# EAGLE design headphone (EAGLE 6.4)
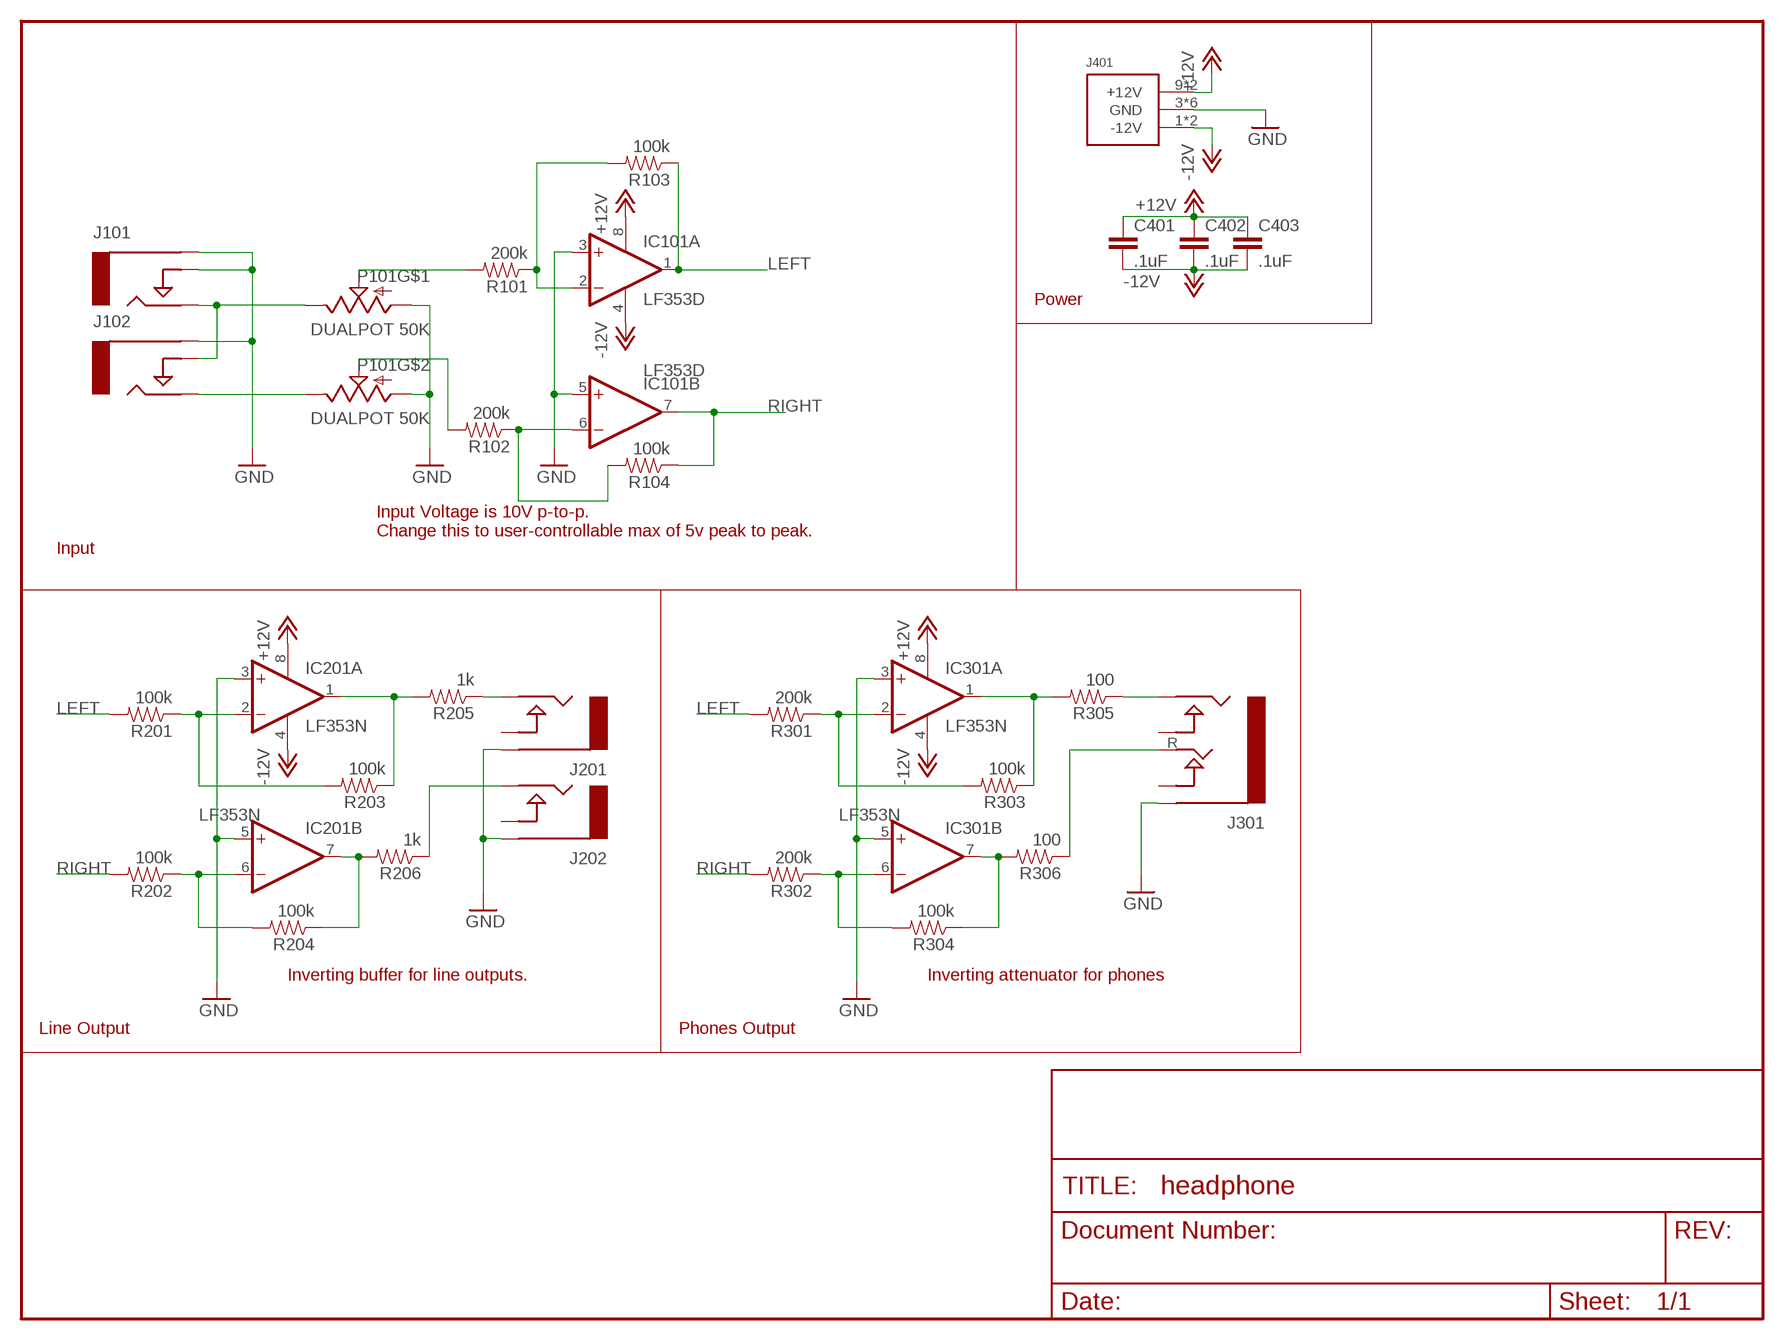
[diagram p0: schematic, sheet 1]

## Parts
C401  .1uF  CAP0603-CAP  [0603-CAP]
C402  .1uF  CAP0603-CAP  [0603-CAP]
C403  .1uF  CAP0603-CAP  [0603-CAP]
IC101  LF353D  [SO08]
IC201  LF353N  [DIL08]
IC301  LF353N  [DIL08]
J101  MONOJACKSWITCHCRAFT3  [SWITCHCRAFT_35RAPC2AV]
J102  MONOJACKSWITCHCRAFT3  [SWITCHCRAFT_35RAPC2AV]
J201  MONOJACKNEUTRIK  [NEUTRIK_NMJ4HHD2]
J202  MONOJACKNEUTRIK  [NEUTRIK_NMJ4HHD2]
J301  STEREOJACK  [NEUTRIK_NMJ6HFD2]
J401  POWER_SIMPLE16  [POWER_16]
P101  DUALPOT 50K  DUALPOT  [ALPSRK09L12B0A31]
R101  200k  RESISTOR0603-RES  [0603-RES]
R102  200k  RESISTOR0603-RES  [0603-RES]
R103  100k  RESISTOR0603-RES  [0603-RES]
R104  100k  RESISTOR0603-RES  [0603-RES]
R201  100k  RESISTOR0603-RES  [0603-RES]
R202  100k  RESISTOR0603-RES  [0603-RES]
R203  100k  RESISTOR0603-RES  [0603-RES]
R204  100k  RESISTOR0603-RES  [0603-RES]
R205  1k  RESISTOR0603-RES  [0603-RES]
R206  1k  RESISTOR0603-RES  [0603-RES]
R301  200k  RESISTOR0603-RES  [0603-RES]
R302  200k  RESISTOR0603-RES  [0603-RES]
R303  100k  RESISTOR0603-RES  [0603-RES]
R304  100k  RESISTOR0603-RES  [0603-RES]
R305  100  RESISTOR0603-RES  [0603-RES]
R306  100  RESISTOR0603-RES  [0603-RES]

## Nets
+12V: C401.1 C402.1 C403.1 IC101.8(P:V+) IC201.8(P:V+) IC301.8(P:V+) J401.9(+12V) J401.10(+12V)
-12V: C401.2 C402.2 C403.2 IC101.4(P:V-) IC201.4(P:V-) IC301.4(P:V-) J401.1(-12V) J401.2(-12V)
GND: IC101.3(A:+IN) IC101.5(B:+IN) IC201.3(A:+IN) IC201.5(B:+IN) IC301.3(A:+IN) IC301.5(B:+IN) J101.S(SLEEVE) J101.TN(NORM) J102.S(SLEEVE) J201.S(SLEEVE) J201.SN(SLEEVE) J202.S(SLEEVE) J202.SN(SLEEVE) J301.S(SLEEVE) J301.SN(SLEEVE) J401.3(GND) J401.4(GND) J401.5(GND) J401.6(GND) J401.7(GND) J401.8(GND) P101.D1(A) P101.D2(A)
J102: J101.T(TIP) J102.TN(NORM) P101.U1(E)
LEFT: IC101.1(A:OUT) R103.1 R201.2 R301.2
N$1: IC101.6(B:-IN) R102.1 R104.2
N$2: P101.W2(S) R102.2
N$3: P101.W1(S) R101.2
N$4: IC101.2(A:-IN) R101.1 R103.2
N$5: J102.T(TIP) P101.U2(E)
N$7: IC201.7(B:OUT) R204.1 R206.2
N$8: IC201.6(B:-IN) R202.1 R204.2
N$9: IC201.2(A:-IN) R201.1 R203.2
N$10: IC201.1(A:OUT) R203.1 R205.2
N$11: IC301.7(B:OUT) R304.1 R306.2
N$12: J201.T(TIP) R205.1
N$13: J202.T(TIP) R206.1
N$14: IC301.6(B:-IN) R302.1 R304.2
N$15: IC301.2(A:-IN) R301.1 R303.2
N$16: IC301.1(A:OUT) R303.1 R305.2
N$17: J301.T(TIP) R305.1
N$18: J301.R(RING) R306.1
RIGHT: IC101.7(B:OUT) R104.1 R202.2 R302.2
Unconnected: J201.TN(NORM) J202.TN(NORM) J301.RN(NORMRING) J301.TN(NORMTIP)

## Notes on the sheet
- Power
- Input Voltage is 10V p-to-p.  
  Change this to user-controllable max of 5v peak to peak.
- Input
- Inverting buffer for line outputs. | Inverting attenuator for phones
- Line Output | Phones Output

## Library data of the parts
C401-C403 = SparkFun:CAP: Capacitor Standard 0603 ceramic capacitor, and 0.1" leaded capacitor.
IC101 IC201 IC301 = linear:LF353: OP AMP
J101 J102 J201 J202 = russruss:MONOJACK
J301 = russruss:STEREOJACK
J401 = eurorack:POWER_SIMPLE
P101 = russruss:DUALPOT
R101-R104 R201-R206 R301-R306 = SparkFun:RESISTOR: Resistor Basic schematic elements and footprints for 0603, 1206, and PTH resistors.

## Board
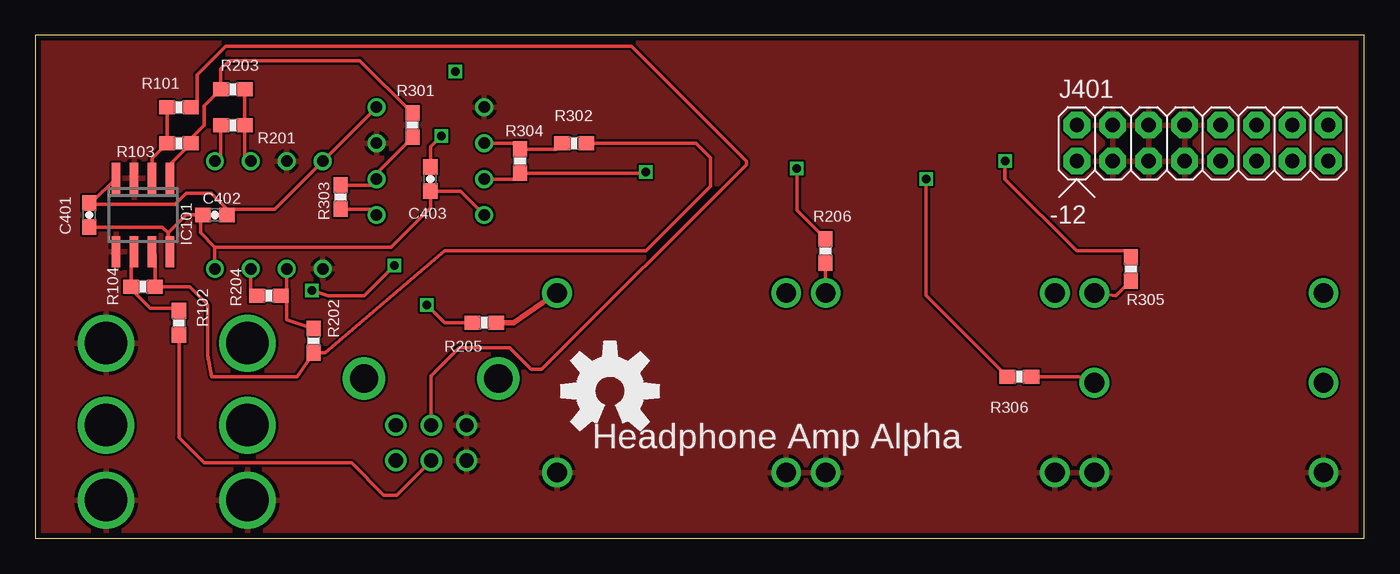
[diagram p1: board, top side]
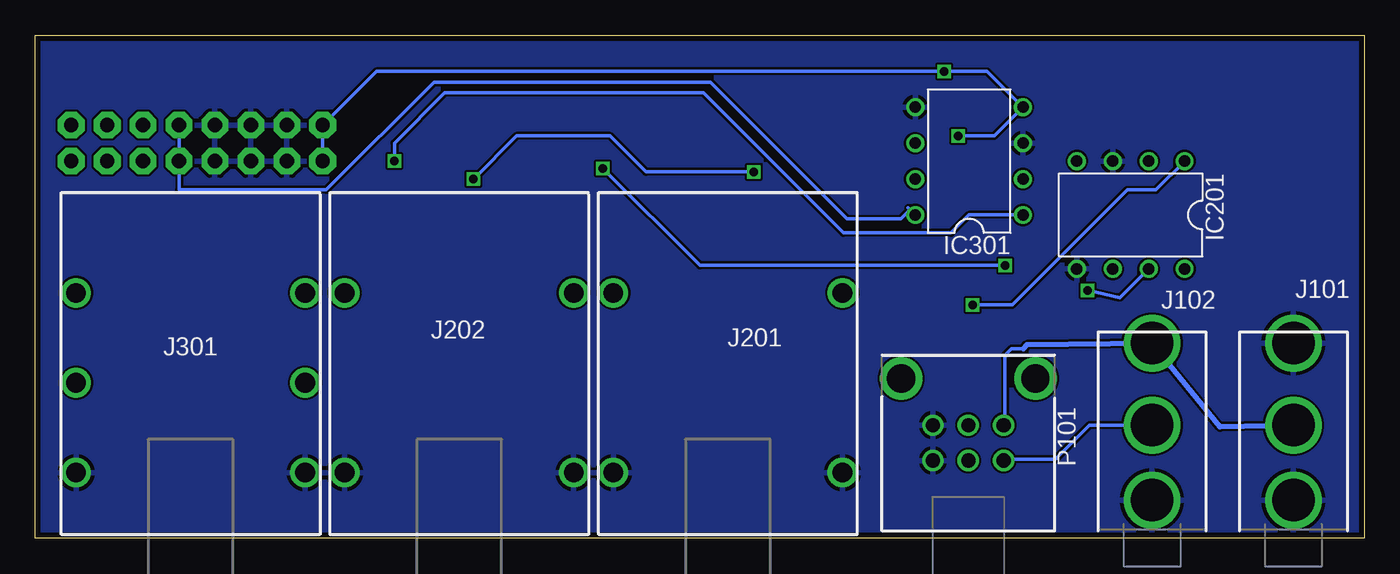
[diagram p2: board, bottom side, seen from below]

Size 93.98 x 35.56 mm. Coordinates in mm from the lower left corner, seen from the top.
Outline: 0,0 93.98,0 93.98,35.56 0,35.56 0,0
Copper layers (1*16): Top 0.0356mm / dielectric 1.5011mm / Bottom 0.0356mm
Design rules "LaenPCBOrder": minimum track width 6mil, minimum drill 13mil, track to track 6mil, track to pad 6mil, pad to pad 6mil, via to via 6mil, smd to smd 6mil, copper to edge 15mil, drill to drill 6mil, minimum pad ring 7mil, minimum via ring 7mil, stop-mask expansion 4mil, vias tented up to drill 0mil, thermal gap 10mil

### Footprints (pad centres in the part's own frame; a part is rotated, then mirrored left to right if it is on the bottom)
0603-CAP = smd 1.1 x 1: 1 -0.85,0; 2 0.85,0
SO08 = smd 0.6 x 2.2: 1 -1.905,-2.6; 2 -0.635,-2.6; 3 0.635,-2.6; 4 1.905,-2.6; 5 1.905,2.6; 6 0.635,2.6; 7 -0.635,2.6; 8 -1.905,2.6
DIL08 = drill 0.813 pad 1.27: 1 -3.81,-3.81; 2 -1.27,-3.81; 3 1.27,-3.81; 4 3.81,-3.81; 5 3.81,3.81; 6 1.27,3.81; 7 -1.27,3.81; 8 -3.81,3.81
SWITCHCRAFT_35RAPC2AV = drill 3 pad 3.5: S 5.3,0 | drill 3: T 0,0; TN -5.8,0
NEUTRIK_NMJ4HHD2 = drill 1.4: S 6.35,8.1; SN 6.35,-8.1; T -6.35,8.1; TN -6.35,-8.1
NEUTRIK_NMJ6HFD2 = drill 1.4: R 0,8.1; RN 0,-8.1; S 6.35,8.1; SN 6.35,-8.1; T -6.35,8.1; TN -6.35,-8.1
POWER_16 = drill 1.016 pad 1.88 octagon: 1 -6.35,-1.27; 2 -6.35,1.27; 3 -3.81,-1.27; 4 -3.81,1.27; 5 -1.27,-1.27; 6 -1.27,1.27; 7 1.27,-1.27; 8 1.27,1.27; 9 3.81,-1.27; 10 3.81,1.27; 11 6.35,-1.27; 12 6.35,1.27; 13 8.89,-1.27; 14 8.89,1.27; 15 11.43,-1.27; 16 11.43,1.27
ALPSRK09L12B0A31 = drill 1: D1 0,-2.5; D2 2.5,-2.5; U1 0,2.5; U2 2.5,2.5; W1 0,0; W2 2.5,0 | drill 2: P$7 -3.3,4.75; P$8 -3.3,-4.75
0603-RES = smd 1.1 x 1: 1 -0.85,0; 2 0.85,0

### Placement (x,y rotation side)
C401  3.81,22.86 90 top
C402  12.7,22.86 0 top
C403  27.94,25.4 90 top
IC101  7.62,22.86 180 top
IC201  16.51,22.86 180 bottom
IC301  27.94,26.67 90 bottom
J101  5,8 270 bottom
J102  15,8 270 bottom
J201  45,11 270 bottom
J202  64,11 270 bottom
J301  83,11 270 bottom
J401  80.01,27.94 0 top
P101  28,8 270 bottom
R101  10.16,30.48 0 top
R102  10.16,15.24 270 top
R103  10.16,27.94 180 top
R104  7.62,17.78 180 top
R201  13.97,31.75 180 top
R202  19.68,13.97 270 top
R203  13.97,29.21 0 top
R204  16.51,17.14 0 top
R205  31.75,15.24 180 top
R206  55.88,20.32 90 top
R301  26.67,29.21 90 top
R302  38.1,27.94 0 top
R303  21.59,24.13 90 top
R304  34.29,26.67 90 top
R305  77.47,19.05 90 top
R306  69.6,11.43 180 top
U$1  [OSHW-LOGO-L]  40.64,10.41 0 top

### Tracks (layer width: path | path; a pad name or v marks a point on that pad's centre or on a via)
+12V
  Top 0.254: C401.1 8.98,22.01 9.4,21.59 | 9.4,21.59 9.4,20.39 IC101.8 | 9.4,21.59 10.67,22.86 C402.1 11.68,22.69 11.68,21.59 12.7,20.57 | IC201.8 12.7,20.57 | IC301.8 30.06,24.55 C403.1 27.94,23.37 25.15,20.57 12.7,20.57
  Bottom 0.254: J401.10 J401.9 83.82,24.64 73.41,24.64 65.79,32.26 46.23,32.26 36.58,22.61 32.77,22.61 32.13,23.24 | 32.26,23.37 32.13,23.24 | 32.13,23.24 IC301.8
-12V  (via drill 0.6)
  Top 0.254: IC101.4 3.96,23.71 C401.2 3.9,23.62 9.91,23.62 10.67,24.38 12.45,24.38 13.55,23.28 | C402.2 13.55,23.28 | 13.55,23.28 16.93,23.28 IC201.4 IC301.4 | C403.2 27.94,27.69 v28.7,28.45
  Bottom 0.254: J401.1 J401.2 69.85,33.02 v29.72,33.02 26.67,33.02 IC301.4 26.16,28.45 v28.7,28.45
GND
  pour Bottom: 0,35.56 93.98,35.56 93.98,0 0,0
  pour Top: 0,35.56 93.98,35.56 93.98,0 0,0
J102
  Bottom 0.254: 24.1,13.42 24.93,13.42 25.4,12.95 25.4,8.1 P101.U1
  Bottom 0.406: J101.T 10.2,7.87 J102.TN 23.85,13.67 24.1,13.42
LEFT
  Top 0.254: IC101.1 9.53,26.45 R103.1 11.01,28.28 11.94,29.21 11.94,30.57 R201.2 13.12,33.19 13.72,33.78 22.95,33.78 R301.2
N$1
  Top 0.254: IC101.6 6.77,20.05 R104.2 6.77,17.61 8.13,16.26 9.99,16.26 R102.1
N$2
  Top 0.254: R102.2 10.16,7.11 11.94,5.33 22.35,5.33 24.64,3.05 25.55,3.05 P101.W2
N$3
  Top 0.254: P101.W1 28,11.49 29.97,13.46 33.53,13.46 35.05,11.94 35.81,11.94 50.29,26.42 50.29,26.67 42.16,34.8 13.46,34.8 11.43,32.77 11.43,30.9 R101.2
N$4
  Top 0.254: R101.1 R103.2 8.26,26.89 IC101.2
N$5
  Bottom 0.254: J102.T 19.43,8 21.84,5.59 25.41,5.59 P101.U2
N$7  (via drill 0.6)
  Top 0.254: R204.1 15.24,17.14 IC201.7 | v25.4,19.3 23.24,17.14 20.7,17.14 v19.56,17.53 | v53.85,26.16 53.85,23.2 R206.2
  Bottom 0.254: v25.4,19.3 46.99,19.3 v53.85,26.16 | v19.56,17.53 17.27,17.02 IC201.7
N$8
  Top 0.254: R204.2 17.78,17.14 | 17.78,17.14 IC201.6 | 17.78,17.14 17.78,15.46 R202.1
N$9
  Top 0.254: R201.1 R203.2 14.82,27.09 IC201.2
N$10  (via drill 0.6)
  Top 0.254: R203.1 13.12,27.09 IC201.1 | R205.2 28.96,15.24 v27.69,16.51
  Bottom 0.254: v27.69,16.51 24.89,16.51 16.76,24.64 14.73,24.64 IC201.1
N$11  (via drill 0.6)
  Top 0.254: IC301.7 33.87,25.4 R304.1 43.09,25.82 v43.18,25.91 | v62.99,25.4 62.99,17.18 R306.2
  Bottom 0.254: v43.18,25.91 50.8,25.91 53.34,28.45 59.94,28.45 v62.99,25.4
N$12
  Top 0.406: R205.1 33.81,15.24 J201.T
N$13
  Top 0.254: R206.1 55.88,17.7 J202.T
N$14
  Top 0.254: IC301.6 33.87,27.94 R304.2 36.83,27.52 R302.1
N$15
  Top 0.254: R303.2 23.71,24.98 IC301.2 24.13,25.82 R301.1
N$16  (via drill 0.6)
  Top 0.254: R303.1 23.71,23.28 IC301.1 | v68.58,26.67 68.58,25.4 73.66,20.32 77.05,20.32 R305.2
  Bottom 0.254: IC301.1 27.94,22.86 29.21,21.59 36.83,21.59 46.74,31.5 65.02,31.5 68.58,27.94 v68.58,26.67
N$17
  Top 0.254: J301.T 76.42,17.14 R305.1
N$18
  Top 0.254: R306.1 73.81,11.43 J301.R
RIGHT
  Top 0.254: IC101.7 8.47,20.05 R104.1 10.92,17.78 12.19,16.51 12.19,12.95 12.48,11.43 18.5,11.43 R202.2 20.49,13.12 28.96,20.32 43.18,20.32 47.75,24.89 47.75,26.92 46.74,27.94 R302.2

### Text on the board
tPlace: Headphone Amp Alpha